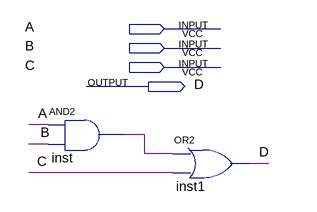
[diagram p0: schematic sheet]
// Quartus schematic thur_per9.bdf as structural Verilog: 2 symbols, 4 pins
module thur_per9 (
  input  A,
  input  B,
  input  C,
  output D
);

  wire inst_out;

  and inst (inst_out, A, B);
  or inst1 (D, inst_out, C);
endmodule
